# EAGLE design final_sch (EAGLE 6.2)
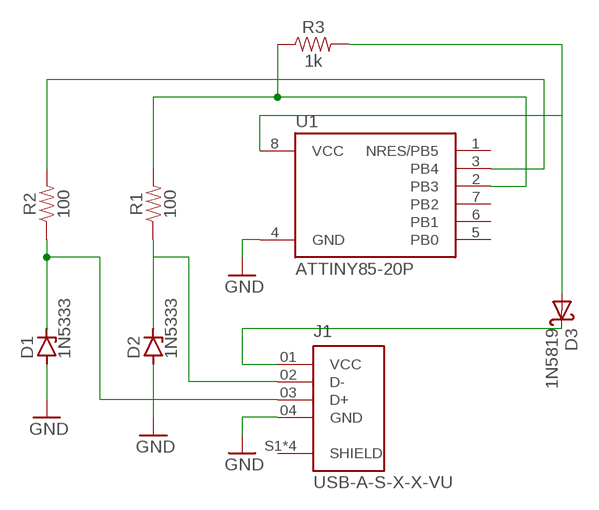
[diagram p0: schematic, sheet 1]

## Parts
D1  1N5333  [C1702-15]
D2  1N5333  [C1702-15]
D3  1N5819  [DO41-10]
J1  USB-A-S-X-X-VU  [SAMTEC_USB-A-S-X-X-VU]
R1  100  100OHM-HORIZ_KIT-1/4W-1%  [AXIAL-0.3EZ]
R2  100  100OHM-HORIZ_KIT-1/4W-1%  [AXIAL-0.3EZ]
R3  1k  1KOHM-HORIZ_KIT-1/4W-5%  [AXIAL-0.3-KIT]
U1  ATTINY85-20P  [PDIP08_300MIL]

## Nets
GND: D1.A D2.A J1.04(GND) U1.4(GND)
N$1: D1.C J1.03(D+) R2.P$1
N$2: D2.C J1.02(D-) R1.P$1
N$3: R2.P$2 U1.3(PB4)
N$4: R1.P$2 R3.P$1 U1.2(PB3)
N$5: D3.C J1.01(VCC)
N$8: D3.A R3.P$2 U1.8(VCC)
Unconnected: J1.S1(SHIELD) J1.S2(SHIELD) J1.S3(SHIELD) J1.S4(SHIELD) U1.1(NRES/PB5) U1.5(PB0) U1.6(PB1) U1.7(PB2)

## Library data of the parts
D1 D2 = diode:1N5333: Z DIODE 3.3 V, 5W, 5 percent (Motorola)
D3 = 1N5819:1N5819: DIODE general purpose rectifier, 1 A Check availability <https://pricing.snapeda.com/parts/1N5819/STMicroelectronics/view-part?ref=eda>; AVAILABILITY: In Stock; CHECK_PRICES: https://www.snapeda.com/parts/1N5819/STMicroelectronics/view-part/?ref=eda; DESCRIPTION: Diode Schottky 40 V 1A Through Hole DO-41; MF: STMicroelectronics; MP: 1N5819; PACKAGE: DO-41 ON Semiconductor; PRICE: None; PURCHASE-URL: https://www.snapeda.com/api/url_track_click_mouser/?unipart_id=2242856&manufacturer=STMicroelectronics&part_name=1N5819&search_term=None; SNAPEDA_LINK: https://www.snapeda.com/parts/1N5819/STMicroelectronics/view-part/?ref=snap
J1 = USB-A-S-X-X-VU:USB-A-S-X-X-VU: USB-A (USB TYPE-A) USB 2.0 Receptacle Connector 4 Position Through Hole, Right Angle Check availability <https://pricing.snapeda.com/parts/USB-A-S-F-B-VU/Samtec/view-part?ref=eda>; AVAILABILITY: In Stock; CHECK_PRICES: https://www.snapeda.com/parts/USB-A-S-F-B-VU/Samtec+Inc./view-part/?ref=eda; DESCRIPTION: USB-A (USB TYPE-A) USB 2.0 Receptacle Connector 4 Position Through Hole, Right Angle; MF: Samtec; MP: USB-A-S-F-B-VU; PACKAGE: None; PRICE: None; PURCHASE-URL: https://www.snapeda.com/api/url_track_click_mouser/?unipart_id=226216&manufacturer=Samtec&part_name=USB-A-S-F-B-VU&search_term=None; SNAPEDA_LINK: https://www.snapeda.com/parts/USB-A-S-F-B-VU/Samtec+Inc./view-part/?ref=snap
R1 R2 = SparkFun-Resistors:100OHM: 100Ω resistor A resistor is a passive two-terminal electrical component that implements electrical resistance as a circuit element. Resistors act to reduce current flow, and, at the same time, act to lower voltage levels within circuits. - Wikipedia; PROD_ID: RES-12181
R3 = SparkFun-Resistors:1KOHM: 1kΩ resistor A resistor is a passive two-terminal electrical component that implements electrical resistance as a circuit element. Resistors act to reduce current flow, and, at the same time, act to lower voltage levels within circuits. - Wikipedia; PROD_ID: RES-08380
U1 = _hhn_attiny25_45_85:ATTINY85*: ATMEL ATtiny 85 Packages: P = PDIP 08 30mil S = SOIC 08 EIAJ 208mil Technologies Note: for complete ordering code (temp. range, finish, tape&reel etc.) see www.atmel.com • Supply Voltage: V = (1.8…5.5)V | [blank] = (2.7…5.5)V • Speed: 10 = 10 MHz | 20 = 20 MHz Author: Dipl.-Ing. FH Rainer Bayer HHN Hochschule Heilbronn (Heilbronn University), rainer.bayer@hs-heilbronn.de Ingenieurbüro ing-rb, mail@ing-rb.de

## Board
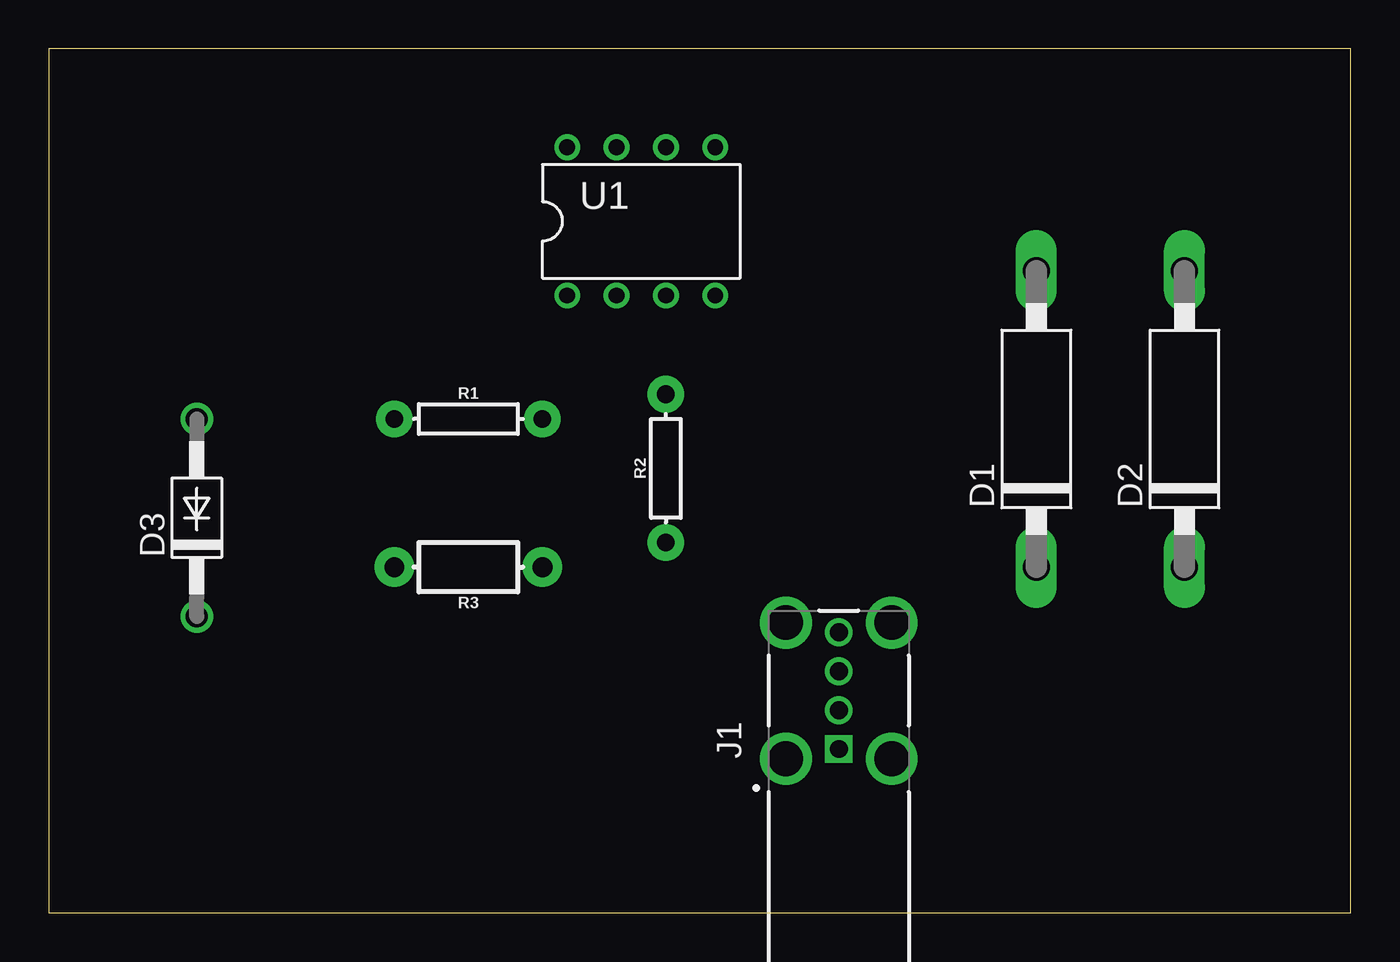
[diagram p1: board, top side]
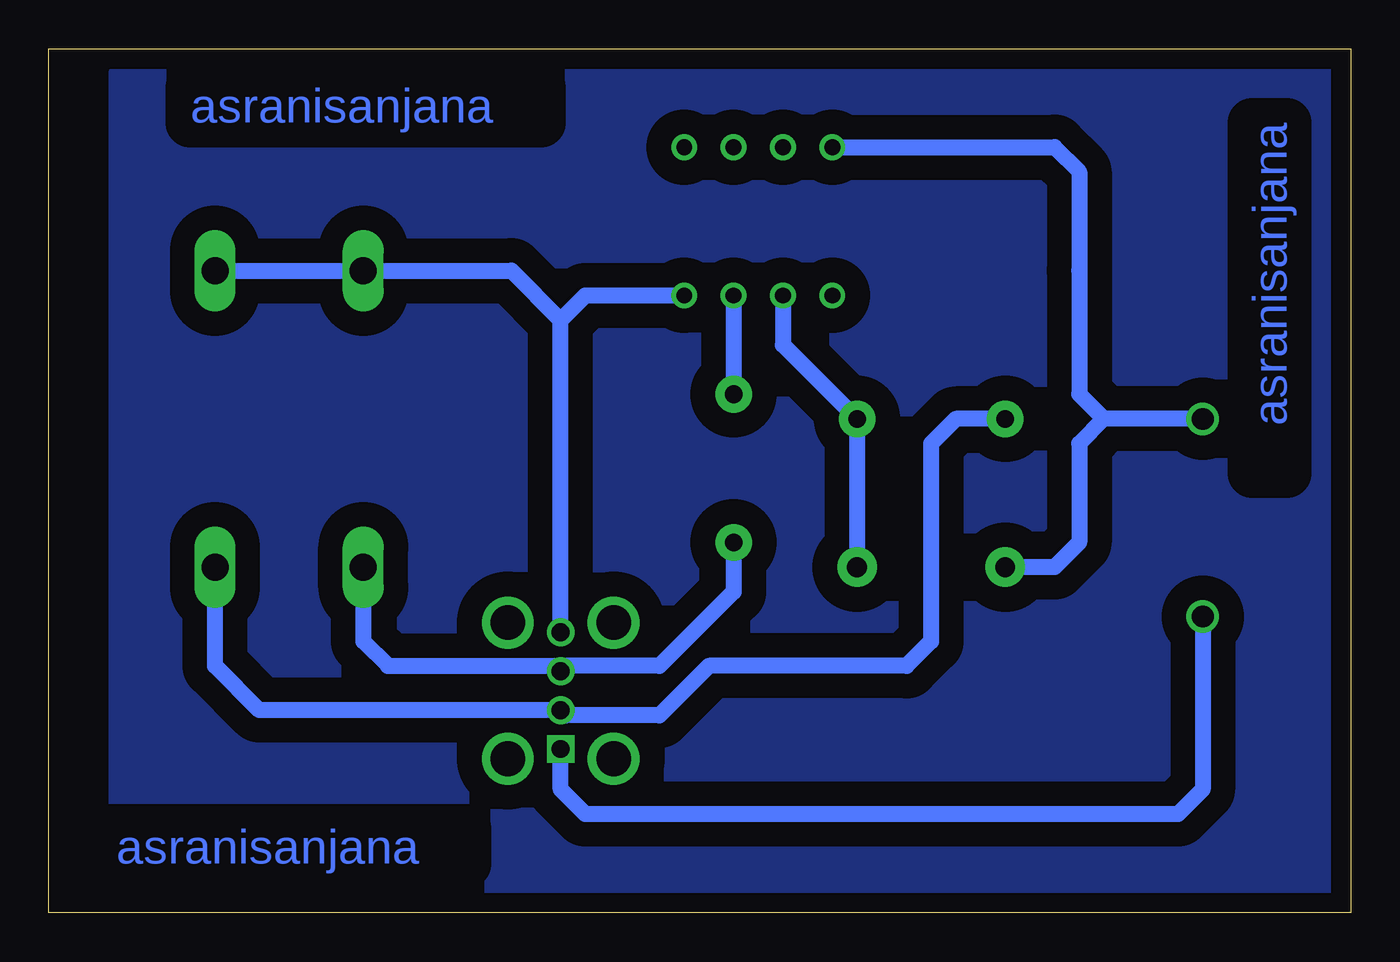
[diagram p2: board, bottom side, seen from below]

Size 66.98 x 44.44 mm. Coordinates in mm from the lower left corner, seen from the top.
Outline: 0,0 66.98,0 66.98,44.44 0,44.44 0,0
Copper layers (1*16): Top 0.035mm / dielectric 1.5mm / Bottom 0.035mm
Design rules: minimum track width 10mil, minimum drill 24mil, track to track 50mil, track to pad 50mil, pad to pad 50mil, via to via 50mil, smd to smd 8mil, copper to edge 40mil, drill to drill 8mil, minimum pad ring 10mil, minimum via ring 8mil, stop-mask expansion 4mil, vias tented up to drill 0mil, thermal gap 10mil

### Footprints (pad centres in the part's own frame; a part is rotated, then mirrored left to right if it is on the bottom)
C1702-15 = drill 1.397 long: A 7.62,0; C -7.62,0
DO41-10 = drill 1.118: A 5.08,0; C -5.08,0
SAMTEC_USB-A-S-X-X-VU = drill 0.92 square: 01 -3,0 | drill 0.92: 02 -1,0; 03 1,0; 04 3,0 | drill 1.78: S1 -3.5,2.72; S2 3.5,2.72; S3 -3.5,-2.72; S4 3.5,-2.72
AXIAL-0.3EZ = drill 0.9 pad 1.88: P$1 -3.81,0; P$2 3.81,0
AXIAL-0.3-KIT = drill 1.016 pad 2.032: P$1 -3.81,0; P$2 3.81,0
PDIP08_300MIL = drill 0.813: 1 -3.81,-3.81; 2 -1.27,-3.81; 3 1.27,-3.81; 4 3.81,-3.81; 5 3.81,3.81; 6 1.27,3.81; 7 -1.27,3.81; 8 -3.81,3.81

### Placement (x,y rotation side)
D1  50.8,25.4 90 top
D2  58.42,25.4 90 top
D3  7.62,20.32 90 top
J1  40.64,11.43 90 top
R1  21.59,25.4 0 top
R2  31.75,22.86 90 top
R3  21.59,17.78 180 top
U1  30.48,35.56 0 top

### Tracks (layer width: path | path; a pad name or v marks a point on that pad's centre or on a via)
GND
  Bottom 0.813: J1.04 40.64,30.48 | 40.64,30.48 39.37,31.75 U1.4 | D2.A D1.A 43.18,33.02 40.64,30.48
N$1
  Bottom 0.813: D1.C 50.8,13.97 49.53,12.7 40.91,12.7 J1.03 40.37,12.7 35.56,12.7 31.75,16.51 R2.P$1
N$2
  Bottom 0.813: R1.P$1 20.32,25.4 21.59,24.13 21.59,13.97 22.86,12.7 33.02,12.7 35.56,10.16 40.37,10.16 J1.02 56.15,10.43 58.42,12.7 D2.C
N$3
  Bottom 0.813: U1.3 R2.P$2
N$4
  Bottom 0.813: U1.2 29.21,29.21 R1.P$2 R3.P$1
N$5
  Bottom 0.813: D3.C 7.62,6.35 8.89,5.08 39.37,5.08 40.64,6.35 J1.01
N$6
  pour Bottom: 1.27,43.18 63.5,43.18 63.5,1.27 1.27,1.27
N$8
  Bottom 0.813: D3.A 12.7,25.4 | 12.7,25.4 13.97,24.13 13.97,19.05 15.24,17.78 R3.P$2 | 12.7,25.4 13.97,26.67 13.97,33.02 13.97,38.1 15.24,39.37 U1.8

### Text on the board
Bottom: asranisanjana | asranisanjana | asranisanjana